# Altium schematic sheet [06] CONNECTIVITY.SchDoc
size A3; Organization: Altium Limited; Address1: L3, 12a Rodborough Rd; Address2: Frenchs Forest; Address3: NSW; Address4: Australia 2086
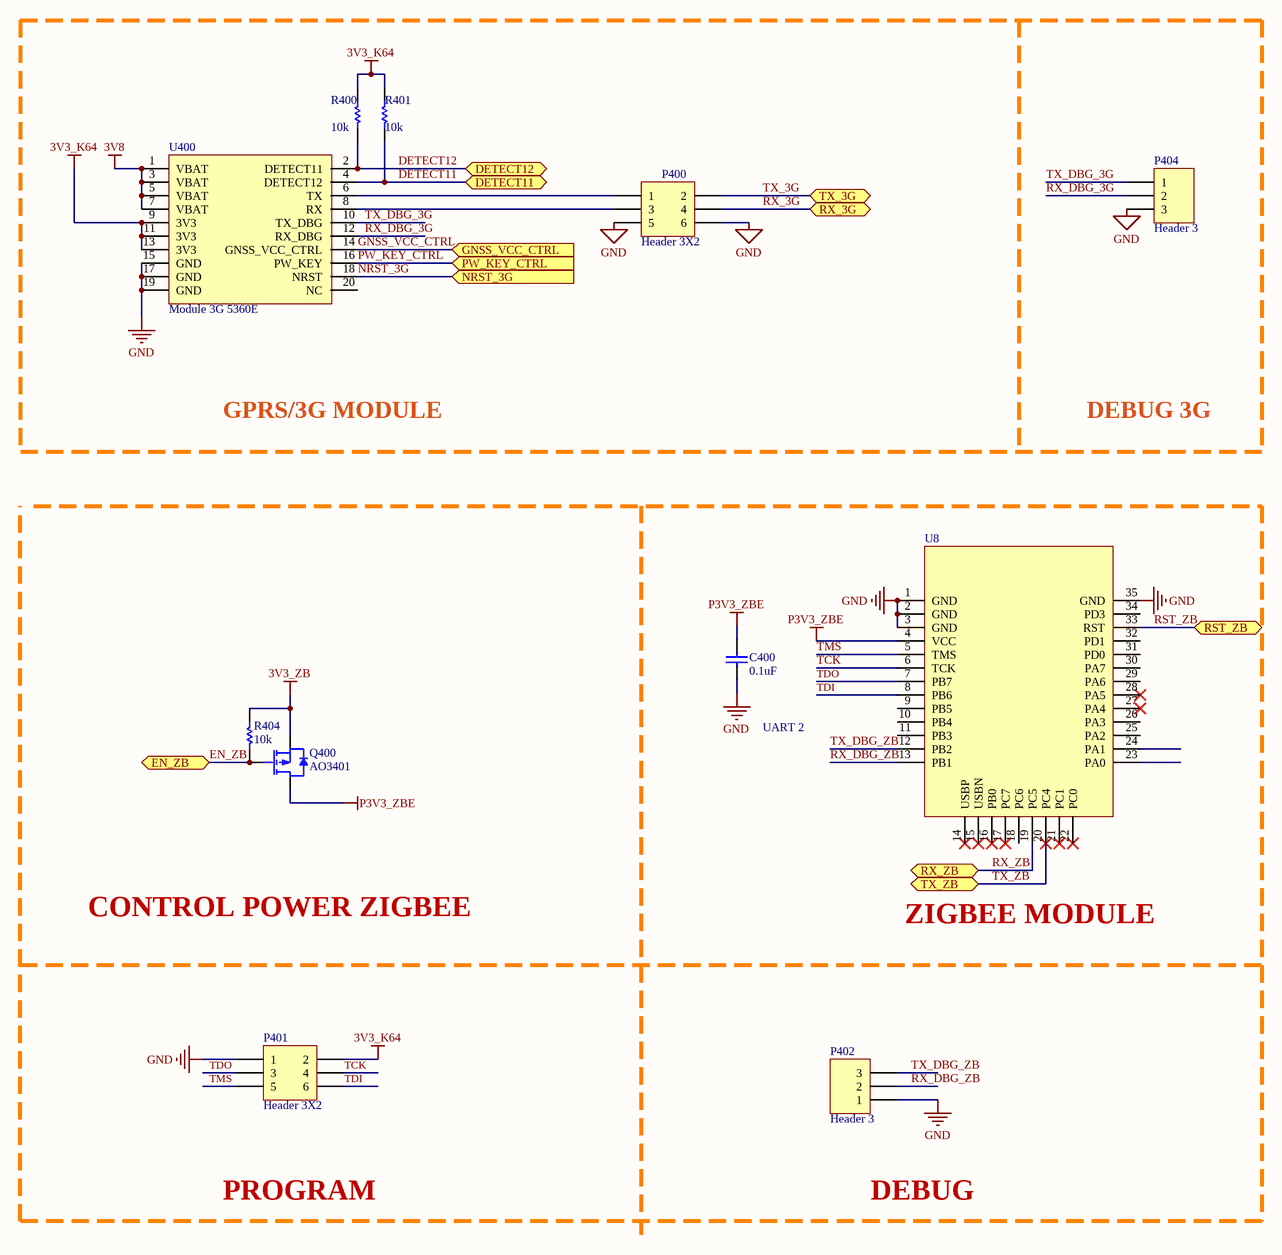
[diagram p0: [06] CONNECTIVITY.SchDoc]

## Parts
C400  0.1uF  [0402C]
P400  Header 3X2  [HDR2X3]
P401  Header 3X2  [HDR2X3]
P402  Header 3  [HDR1X3]
P404  Header 3  [HDR1X3]
Q400  AO3401  [SOT23-3N]
R400  10k  [0603R]
R401  10k  [0603R]
R404  10k  [0603R]
U8  (no value)  [VZIGMOD2]
U400  Module 3G 5360E  [Module 3G]

## Ports
DETECT11, DETECT12, EN_ZB, GNSS_VCC_CTRL (in), NRST_3G (in), PW_KEY_CTRL (in), RST_ZB, RX_3G, RX_ZB, TX_3G, TX_ZB

## Nets
3V3_K64: P401.2 R400.2 R401.2 U400.9(3V3) U400.11(3V3) U400.13(3V3)
3V3_ZB: Q400.2(S) R404.2
3V8: U400.1(VBAT) U400.3(VBAT) U400.5(VBAT) U400.7(VBAT)
GND: C400.1 P400.5 P400.6 P401.1 P402.1 P404.3 U8.1(GND) U8.2(GND) U8.3(GND) U8.35(GND) U400.15(GND) U400.17(GND) U400.19(GND)
P3V3_ZBE: C400.2 Q400.3(D) U8.4(VCC)
DETECT11: R401.1 U400.4(DETECT12) ; port DETECT11
DETECT12: R400.1 U400.2(DETECT11) ; port DETECT12
EN_ZB: Q400.1(G) R404.1 ; port EN_ZB
GNSS_VCC_CTRL: U400.14(GNSS_VCC_CTRL) ; port GNSS_VCC_CTRL
NRST_3G: U400.18(NRST) ; port NRST_3G
PW_KEY_CTRL: U400.16(PW_KEY) ; port PW_KEY_CTRL
RST_ZB: U8.33(RST) ; port RST_ZB
RX_3G: P400.4 ; port RX_3G
RX_DBG_3G: P404.2 U400.12(RX_DBG)
RX_DBG_ZB: P402.2 U8.13(PB1)
RX_ZB: U8.19(PC5) ; port RX_ZB
TCK: P401.4 U8.6(TCK)
TDI: P401.6 U8.8(PB6)
TDO: P401.3 U8.7(PB7)
TMS: P401.5 U8.5(TMS)
TX_3G: P400.2 ; port TX_3G
TX_DBG_3G: P404.1 U400.10(TX_DBG)
TX_DBG_ZB: P402.3 U8.12(PB2)
TX_ZB: U8.20(PC4) ; port TX_ZB
NetP400_1: P400.1 U400.6(TX)
NetP400_3: P400.3 U400.8(RX)

Not connected (* = marked no-connect by the designer): U8 9(PB5) 10(PB4) 11(PB3) 14(USBP)* 15(USBN)* 16(PB0)* 17(PC7)* 18(PC6) 21(PC1)* 22(PC0)* 23(PA0) 24(PA1) 25(PA2) 26(PA3) 27(PA4)* 28(PA5)* 29(PA6) 30(PA7) 31(PD0) 32(PD1) 34(PD3); U400 20(NC)

## Notes on the sheet
- GPRS/3G MODULE
- DEBUG 3G
- UART 2
- CONTROL POWER ZIGBEE
- ZIGBEE MODULE
- PROGRAM
- DEBUG

## Library data of the parts
C400 = CAP0.1u0402: CAP CER 0.1UF 16V X7R 0402; Manufacturer: Samsung Electro-Mechanics; Manufacturer Part Number: CL05B104KO5NNNC; Tolerance: ±10%; Notification: Current market demand for these product types have resulted in fluctuating and extending lead times. Lead times may differ.; Module: Connectivity; Supplier 1: Digi-Key; Supplier Part Number 1: 1276-1001-6-ND; RoHS: RoHS Compliant; Category: Capacitors; Stock 1: 100000; Pricing 1: 1=0.1, 10=0.03, 100=0.0134, 500=0.00958, 1000=0.00753, 2500=0.00684, 5000=0.0063 (USD); Packaging: Digi-Reel®; Part Status: Active; Voltage - Rated: 16V; Temperature Coefficient: X7R; Operating Temperature: -55°C ~ 125°C; Features: -; Ratings: -; Applications: General Purpose; Mounting Type: Surface Mount, MLCC; Package / Case: 0402 (1005 Metric); Size / Dimension: 0.039" L x 0.020" W (1.00mm x 0.50mm); Height - Seated (Max): -; Thickness (Max): 0.022" (0.55mm); Lead Spacing: -; Lead Style: -; ComponentLink1URL: http://www.samsungsem.com/kr/support/product-search/mlcc/CL05B104KO5NNNC.jsp; ComponentLink1Description: http://www.samsungsem.com/kr/support/product-search/mlcc/CL05B104KO5NNNC.jsp
P400 P401 = Header 3X2: Header, 3-Pin, Dual row; LatestRevisionDate: 17-Jul-2002; LatestRevisionNote: Re-released for DXP Platform.; Publisher: Altium Limited
P402 P404 = Header 3: Header, 3-Pin; LatestRevisionDate: 17-Jul-2002; LatestRevisionNote: Re-released for DXP Platform.; Publisher: Altium Limited
Q400 = MOSFET-P1: P-Channel MOSFET
R400 R401 R404 = RES10k0603: RES SMD 10K OHM 1% 1/10W 0603; Manufacturer: Panasonic Electronic Components; Manufacturer Part Number: ERJ-3EKF1002V; Power (Watts): 0.1W, 1/10W; Temperature Coefficient: ±100ppm/°C; Supplier 1: Digi-Key; RoHS: RoHS Compliant; Category: Resistors; Stock 1: 0; Pricing 1: 1=0.1, 10=0.021, 100=0.0087, 1000=0.00389, 2500=0.00338 (USD); Packaging: Digi-Reel®; Part Status: Active; Resistance (Ohms): 10k; Tolerance: ±1%; Composition: Thick Film; Features: Automotive AEC-Q200; Operating Temperature: -55°C ~ 155°C; Package / Case: 0603 (1608 Metric); Supplier Device Package: 0603; Size / Dimension: 0.063" L x 0.031" W (1.60mm x 0.80mm); Height - Seated (Max): 0.022" (0.55mm); Failure Rate: -; ComponentLink1URL: https://industrial.panasonic.com/cdbs/www-data/pdf/RDA0000/AOA0000C298.pdf; ComponentLink1Description: https://industrial.panasonic.com/cdbs/www-data/pdf/RDA0000/AOA0000C298.pdf; Supplier Part Number 1: P10.0KHDKR-ND
U8 = VZIGMOD2